# EAGLE design Adafruit tftcaptouchshield v2.3 (EAGLE 6.4)
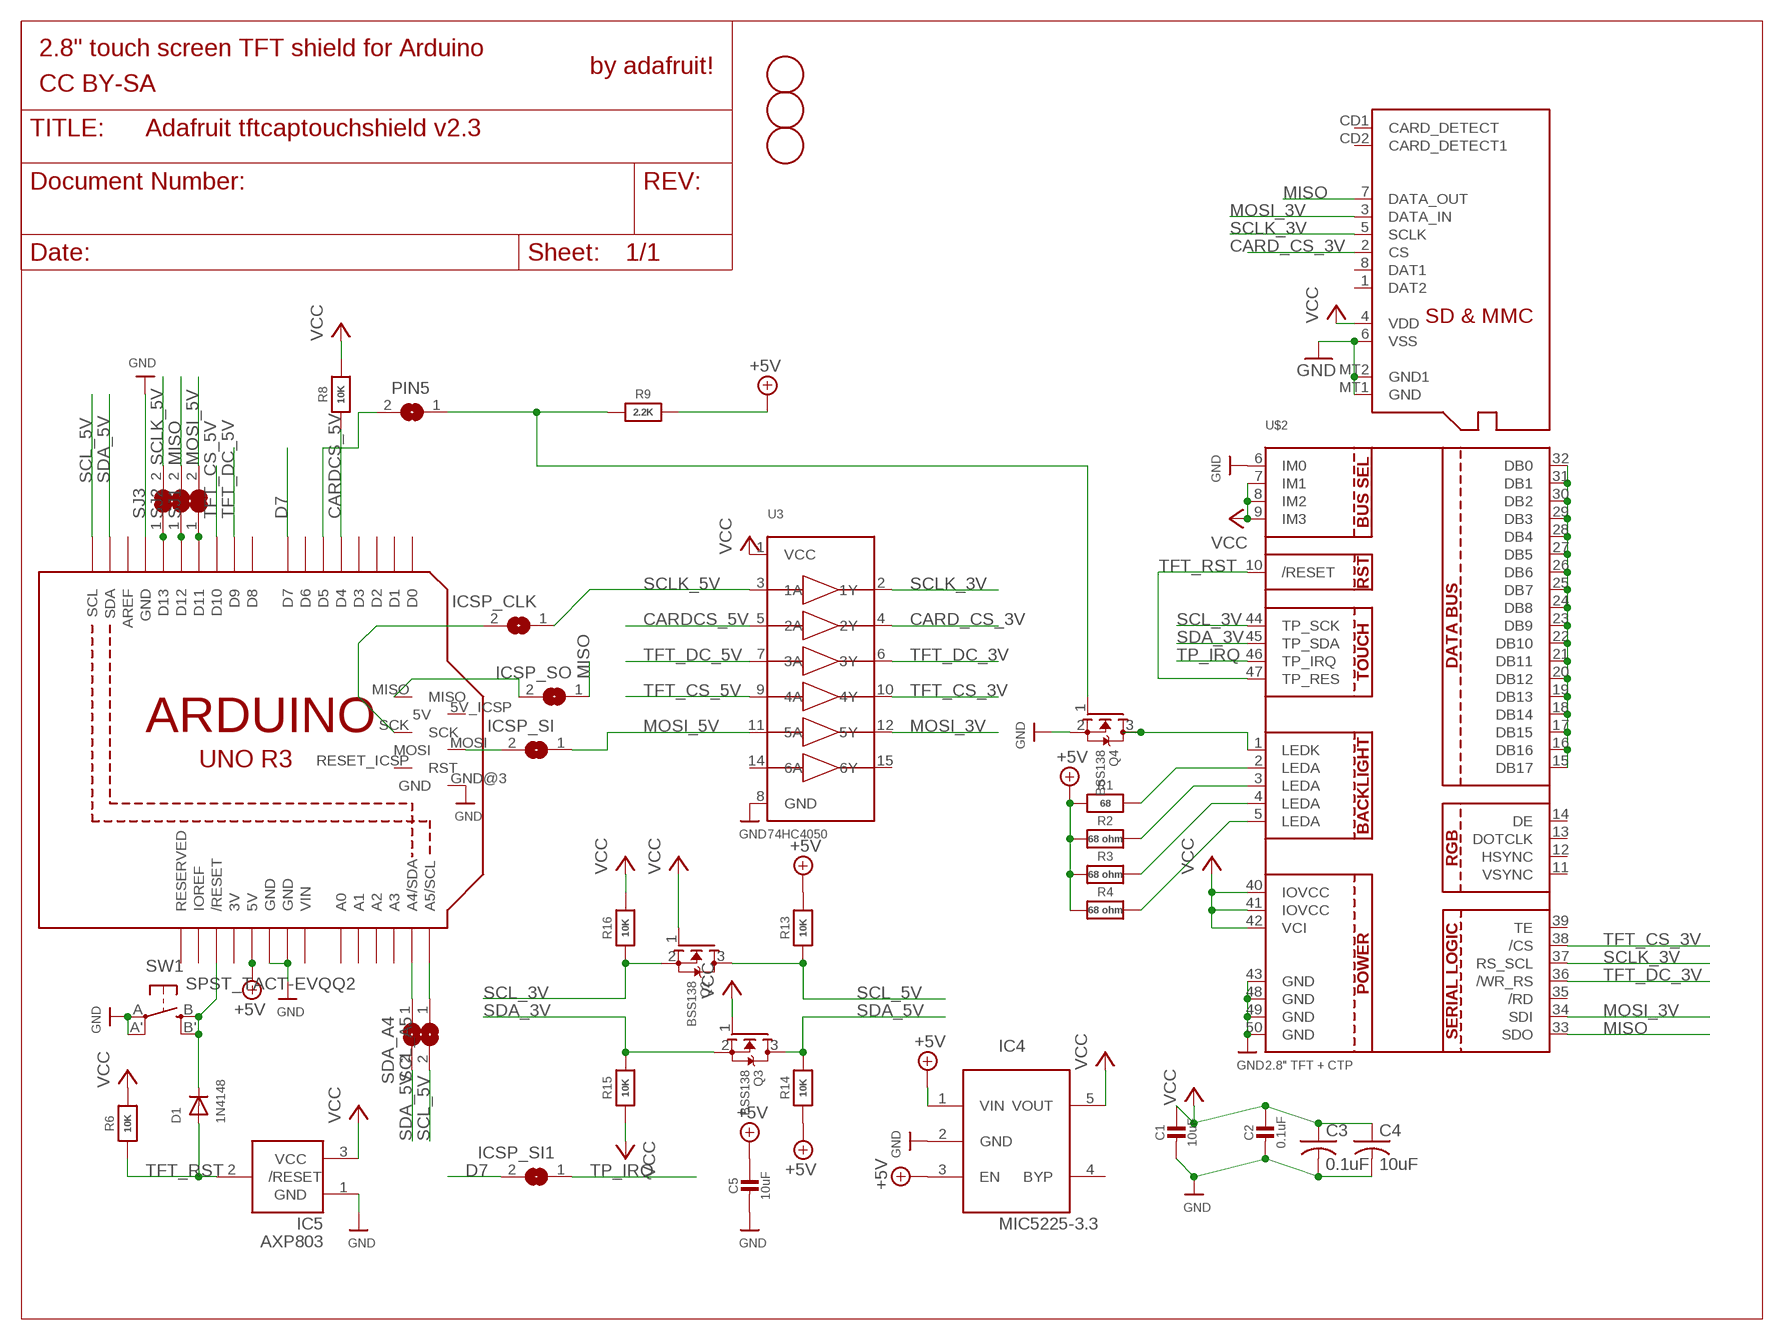
[diagram p0: schematic, sheet 1]

## Parts
C1  10uF  CAP_CERAMIC0805-NOOUTLINE  [0805-NO]
C2  0.1uF  CAP_CERAMIC0805-NOOUTLINE  [0805-NO]
C3  0.1uF  C-USC0805K  [C0805K]
C4  10uF  C-USC0805K  [C0805K]
C5  10uF  CAP_CERAMIC0805-NOOUTLINE  [0805-NO]
D1  1N4148  DIODESOD-323F  [SOD-323F]
IC4  MIC5225-3.3  LP298XS  [SOT23-5L]
IC5  AXP803  AXP083-SAG  [SOT23]
ICSP_CLK  SOLDERJUMPERREFLOW_NOPASTE  [SOLDERJUMPER_REFLOW_NOPASTE]
ICSP_SI  SOLDERJUMPERREFLOW_NOPASTE  [SOLDERJUMPER_REFLOW_NOPASTE]
ICSP_SI1  SOLDERJUMPERREFLOW_NOPASTE  [SOLDERJUMPER_REFLOW_NOPASTE]
ICSP_SO  SOLDERJUMPERREFLOW_NOPASTE  [SOLDERJUMPER_REFLOW_NOPASTE]
PIN5  SOLDERJUMPERREFLOW_NOPASTE  [SOLDERJUMPER_REFLOW_NOPASTE]
Q2  BSS138  MOSFET-NWIDE  [SOT23-WIDE]
Q3  BSS138  MOSFET-NWIDE  [SOT23-WIDE]
Q4  BSS138  MOSFET-NWIDE  [SOT23-WIDE]
R1  68  RESISTOR0805_NOOUTLINE  [0805-NO]
R2  68 ohm  RESISTOR0805_NOOUTLINE  [0805-NO]
R3  68 ohm  RESISTOR0805_NOOUTLINE  [0805-NO]
R4  68 ohm  RESISTOR0805_NOOUTLINE  [0805-NO]
R6  10K  RESISTOR0805_NOOUTLINE  [0805-NO]
R8  10K  RESISTOR0805_NOOUTLINE  [0805-NO]
R9  2.2K  RESISTOR0805_NOOUTLINE  [0805-NO]
R13  10K  RESISTOR0805_NOOUTLINE  [0805-NO]
R14  10K  RESISTOR0805_NOOUTLINE  [0805-NO]
R15  10K  RESISTOR0805_NOOUTLINE  [0805-NO]
R16  10K  RESISTOR0805_NOOUTLINE  [0805-NO]
SCL_A5  SOLDERJUMPERREFLOW_NOPASTE  [SOLDERJUMPER_REFLOW_NOPASTE]
SDA_A4  SOLDERJUMPERREFLOW_NOPASTE  [SOLDERJUMPER_REFLOW_NOPASTE]
SJ1  SOLDERJUMPER_CLOSED  [SOLDERJUMPER_CLOSEDWIRE]
SJ2  SOLDERJUMPER_CLOSED  [SOLDERJUMPER_CLOSEDWIRE]
SJ3  SOLDERJUMPER_CLOSED  [SOLDERJUMPER_CLOSEDWIRE]
SW1  SPST_TACT-EVQQ2  [EVQ-Q2]
U3  74HC4050  74HC4050D  [SOIC16]
U$2  2.8" TFT + CTP  DISP_LCD_CTP28_SAMPLE  [TFT_2.83IN_240X320_50PIN]
U$3  MICROSD  [MICROSD]
U$10  FIDUCIAL  [FIDUCIAL_1MM]
U$11  FIDUCIAL  [FIDUCIAL_1MM]
U$17  ARDUINO_R3_ICSPSMT  [ARDUINOR3_ICSP_SMT]
U$19  FIDUCIAL  [FIDUCIAL_1MM]

## Nets
+5V: C5.1 IC4.1(VIN) IC4.3(EN) R1.1 R2.1 R3.1 R4.1 R9.2 R13.2 R14.1 U$17.5V
CARD_CS_3V: U3.4(2Y) U$3.2(CS)
CARDCS_5V: R8.1 U3.5(2A) U$17.D4
D7: ICSP_SI1.2 U$17.D7
GND: C1.2 C2.2 C3.2 C4.2 C5.2 IC4.2(GND) IC5.1(GND) Q4.2(S) SW1.A'(P1) SW1.A(P) U3.8(GND) U$2.6(IM0) U$2.43(GND) U$2.48(GND) U$2.49(GND) U$2.50(GND) U$3.6(VSS) U$3.MT1(GND) U$3.MT2(GND1) U$17.GND U$17.GND@1(GND) U$17.GND@2(GND) U$17.GND@3(GND)
MISO: ICSP_SO.1 SJ2.2 U$2.33(SDO) U$3.7(DATA_OUT)
MOSI_3V: U3.12(5Y) U$2.34(SDI) U$3.3(DATA_IN)
MOSI_5V: ICSP_SI.1 SJ1.2 U3.11(5A)
N$1: Q4.3(D) U$2.1(LEDK)
N$2: R1.2 U$2.2(LEDA)
N$3: R2.2 U$2.3(LEDA)
N$4: R3.2 U$2.4(LEDA)
N$5: PIN5.1 Q4.1(G) R9.1
N$6: ICSP_SI.2 U$17.MOSI
N$7: PIN5.2 U$17.D5
N$8: D1.C SW1.B'(S1) SW1.B(S) U$17.RESET(/RESET)
N$9: U$2.15(DB17) U$2.16(DB16) U$2.17(DB15) U$2.18(DB14) U$2.19(DB13) U$2.20(DB12) U$2.21(DB11) U$2.22(DB10) U$2.23(DB9) U$2.24(DB8) U$2.25(DB7) U$2.26(DB6) U$2.27(DB5) U$2.28(DB4) U$2.29(DB3) U$2.30(DB2) U$2.31(DB1) U$2.32(DB0)
N$10: R4.2 U$2.5(LEDA)
N$11: ICSP_SO.2 U$17.MISO
N$12: ICSP_CLK.2 U$17.SCK
N$13: SJ3.1 U$17.D13
N$14: SJ2.1 U$17.D12
N$15: SJ1.1 U$17.D11
N$17: SDA_A4.1 U$17.A4(A4/SDA)
N$18: SCL_A5.1 U$17.A5(A5/SCL)
SCL_3V: Q2.2(S) R16.1 U$2.44(TP_SCK)
SCL_5V: Q2.3(D) R13.1 SCL_A5.2 U$17.SCL
SCLK_3V: U3.2(1Y) U$2.37(RS_SCL) U$3.5(SCLK)
SCLK_5V: ICSP_CLK.1 SJ3.2 U3.3(1A)
SDA_3V: Q3.2(S) R15.2 U$2.45(TP_SDA)
SDA_5V: Q3.3(D) R14.2 SDA_A4.2 U$17.SDA
TFT_CS_3V: U3.10(4Y) U$2.38(/CS)
TFT_CS_5V: U3.9(4A) U$17.D10
TFT_DC_3V: U3.6(3Y) U$2.36(/WR_RS)
TFT_DC_5V: U3.7(3A) U$17.D9
TFT_RST: D1.A IC5.2(/RESET) R6.1 U$2.10(/RESET) U$2.47(TP_RES)
TP_IRQ: ICSP_SI1.1 U$2.46(TP_IRQ)
VCC: C1.1 C2.1 C3.1 C4.1 IC4.5(VOUT) IC5.3(VCC) Q2.1(G) Q3.1(G) R6.2 R8.2 R15.1 R16.2 U3.1(VCC) U$2.7(IM1) U$2.8(IM2) U$2.9(IM3) U$2.40(IOVCC) U$2.41(IOVCC) U$2.42(VCI) U$3.4(VDD)
Unconnected: IC4.4(BYP) U3.14(6A) U3.15(6Y) U$2.11(VSYNC) U$2.12(HSYNC) U$2.13(DOTCLK) U$2.14(DE) U$2.35(/RD) U$2.39(TE) U$3.1(DAT2) U$3.8(DAT1) U$3.CD1(CARD_DETECT) U$3.CD2(CARD_DETECT1) U$17.5V_ICSP(5V) U$17.A0 U$17.A1 U$17.A2 U$17.A3 U$17.AREF U$17.D0 U$17.D1 U$17.D2 U$17.D3 U$17.D6 U$17.D8 U$17.IOREF U$17.RESERVED U$17.RESET_ICSP(RST)

## Notes on the sheet
- 2.8" touch screen TFT shield for Arduino
- by adafruit!
- CC BY-SA

## Power pins joined to a net without a drawn wire
3V: U$17.3V
VIN: U$17.VIN

## Library data of the parts
C1 C2 C5 = microbuilder:CAP_CERAMIC: Ceramic Capacitors For new designs, use the packages preceded by an '_' character since they are more reliable: The following footprints should be used on most boards: _0402 - Standard footprint for regular board layouts _0603 - Standard footprint for regular board layouts _0805 - Standard footprint for regular board layouts _1206 - Standard footprint for regular board layouts For extremely tight-pitch boards where space is at a premium, the following 'micro-pitch' footprints can be used (smaller pads, no silkscreen outline, etc.): _0402MP - Micro-pitch footprint for very dense/compact boards _0603MP - Micro-pitch footprint for very dense/compact boards _0805MP - Micro-pitch footprint for very dense/compact boards _1206MP - Micro-pitch footprint for very dense/compact boards
C3 C4 = adafruit:C-US: CAPACITOR, American symbol
D1 = adafruit:DIODE: Diode SMADIODE - SMA Surface Mount Package 20V 1A Schottky Diode Digikey: 641-1014-6-ND DO-1N4148 - Through Hole Small Current Diode SOD-123 20V 1 A (.5mV Vf) Schottky Diode - Digikey: MBRX120TPMSCT-ND SOD-323 10V 570mA (.38mV Vf, 3ns) Schottky Diode - Digikey: ZLLS410CT-ND SOD-523 30V 30mA Schottky Diode (RB751S-40TE61) - Digikey: RB751S-40TE61CT-ND SOT23-R/W - SOT23 Package (R = Solder Paste/Reflow Ovens, W = Hand-Soldering) BAT54Film 40V 300mA - Digikey: 497-7162-1-ND
IC4 = adafruit:LP298X
IC5 = adafruit:AXP083
ICSP_CLK ICSP_SI ICSP_SI1 ICSP_SO PIN5 SCL_A5 SDA_A4 = microbuilder:SOLDERJUMPER: SMD Solder JUMPER Solder the two pads together to create a connection, or remove the solder to break it. REFLOW - Use this footprint for solder paste and reflow ovens. WAVE - Use this footprint for hand-soldering (larger pads). CLOSED - Has a trace between the two pads to ensure it is closed by default. The trace needs to be cut to disable the jumper, and can be closed again by creating a solder bridge between the two pads.
Q2-Q4 = microbuilder:MOSFET-N: N-Channel Mosfet LEGEND VDS: Voltage Drain-Source ID: Drain Current RDS(ON): Drain-Source On-State Resistance VGS(TH): Gate-Source Threshold Voltage CISS: Drain-Source Input Capacitance SOT-23 Name VDS ID RDS(ON) VGS(TH) CISS Order Number 2N7002E 60V 260mA 2.5 Ohm 2.5V @ 250uA 26.7pF @ 25V 2N7002ET1GOSTR-ND BSH103 30V 850mA 400 mOhm 400mV @ 1mA 83pF @ 24V BSH103,235-ND BSS138 60V 320mA 1.6 Ohm 1.5V @ 250uA 50pF @ 10V Mouser: 771-BSS138PW115 DMN2075U-7 20V 4.2A 38 mOhm 1V @ 250 uA 594.3pF @ 10V DMN2075U-7DICT-ND * BSS138 good choice for I2C level-shifting POWERPAK 1212-8 Name VDS ID RDS(ON) VGS(TH) CISS Order Number Si7308DN 60V 6A 58 mOhm 3V @ 250uA 665pF @ 15V SI7308DN-T1-E3CT-ND
R1-R4 R6 R8 R9 R13-R16 = microbuilder:RESISTOR: Resistors For new designs, use the packages preceded by an '_' character since they are more reliable: The following footprints should be used on most boards: _0402 - Standard footprint for regular board layouts _0603 - Standard footprint for regular board layouts _0805 - Standard footprint for regular board layouts _1206 - Standard footprint for regular board layouts For extremely tight-pitch boards where space is at a premium, the following 'micro-pitch' footprints can be used (smaller pads, no silkscreen outline, etc.): _0402MP - Micro-pitch footprint for very dense/compact boards _0603MP - Micro-pitch footprint for very dense/compact boards _0805MP - Micro-pitch footprint for very dense/compact boards _1206MP - Micro-pitch footprint for very dense/compact boards
SJ1-SJ3 = microbuilder:SOLDERJUMPER_CLOSED: Solder Jumper - Closed These solder jumpers are closed by default CLOSEDWIRE - 10 mil trace between pads that can be cut and resoldered later CLOSEDPERM - 63 mil trace between pads for a permanent connection (used to 'bridge' two signals, a shameless hack for Eagle). Can double as a test point as well (no cream layer)
SW1 = adafruit:SPST_TACT: SMT 6mm switch, EVQQ2 series http://www.ladyada.net/library/eagle
U3 = microbuilder:74HC4050D: 6-channel level shifter 74HC4050D - 2V-6V Supply SOIC16 Digikey: 74HC4050D,653-ND Mouser: 771-74HC4050D-T TSSOP16 Digikey: 296-9215-1-ND Mouser:
U$2 = microbuilder:DISP_LCD_CTP28: 2.83" 240x320 Pixel Capacitive Touch Display
U$3 = adafruit:MICROSD: Micro-SD / Transflash card holder with SPI pinout For the 3M # 2908-05WB-MG and/or 4UCON #19656 push-push type
U$10 U$11 U$19 = adafruit:FIDUCIAL: For use by pick and place machines to calibrate the vision/machine, 1mm By microbuilder.eu
U$17 = adafruit:ARDUINO_R3_ICSP

## Board
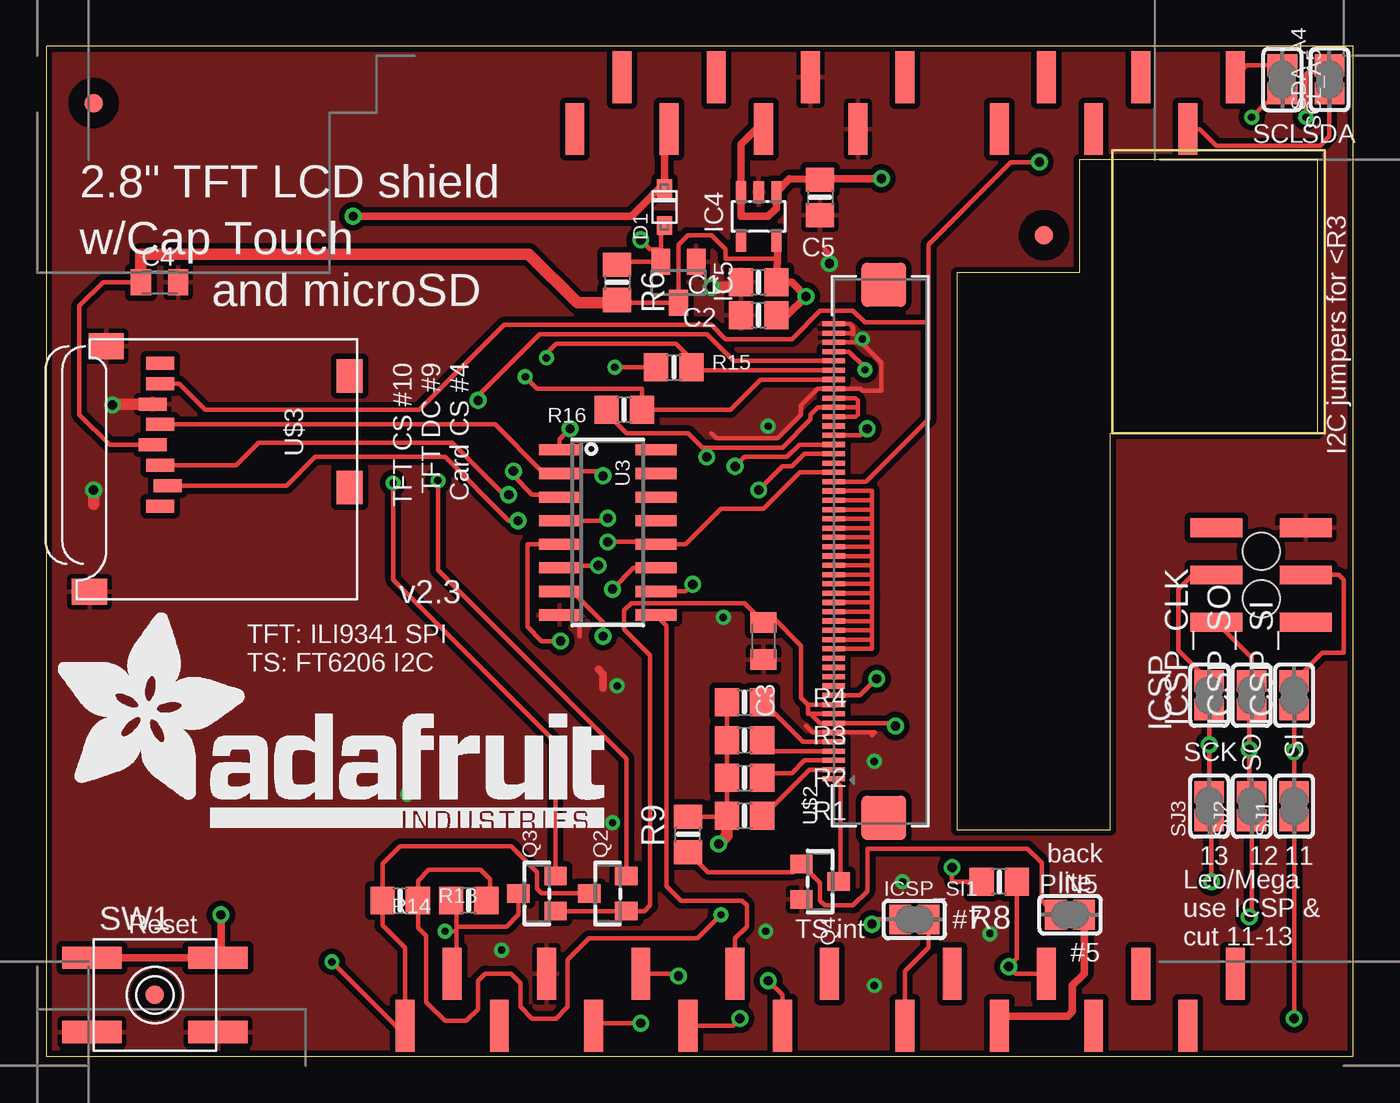
[diagram p1: board, top side]
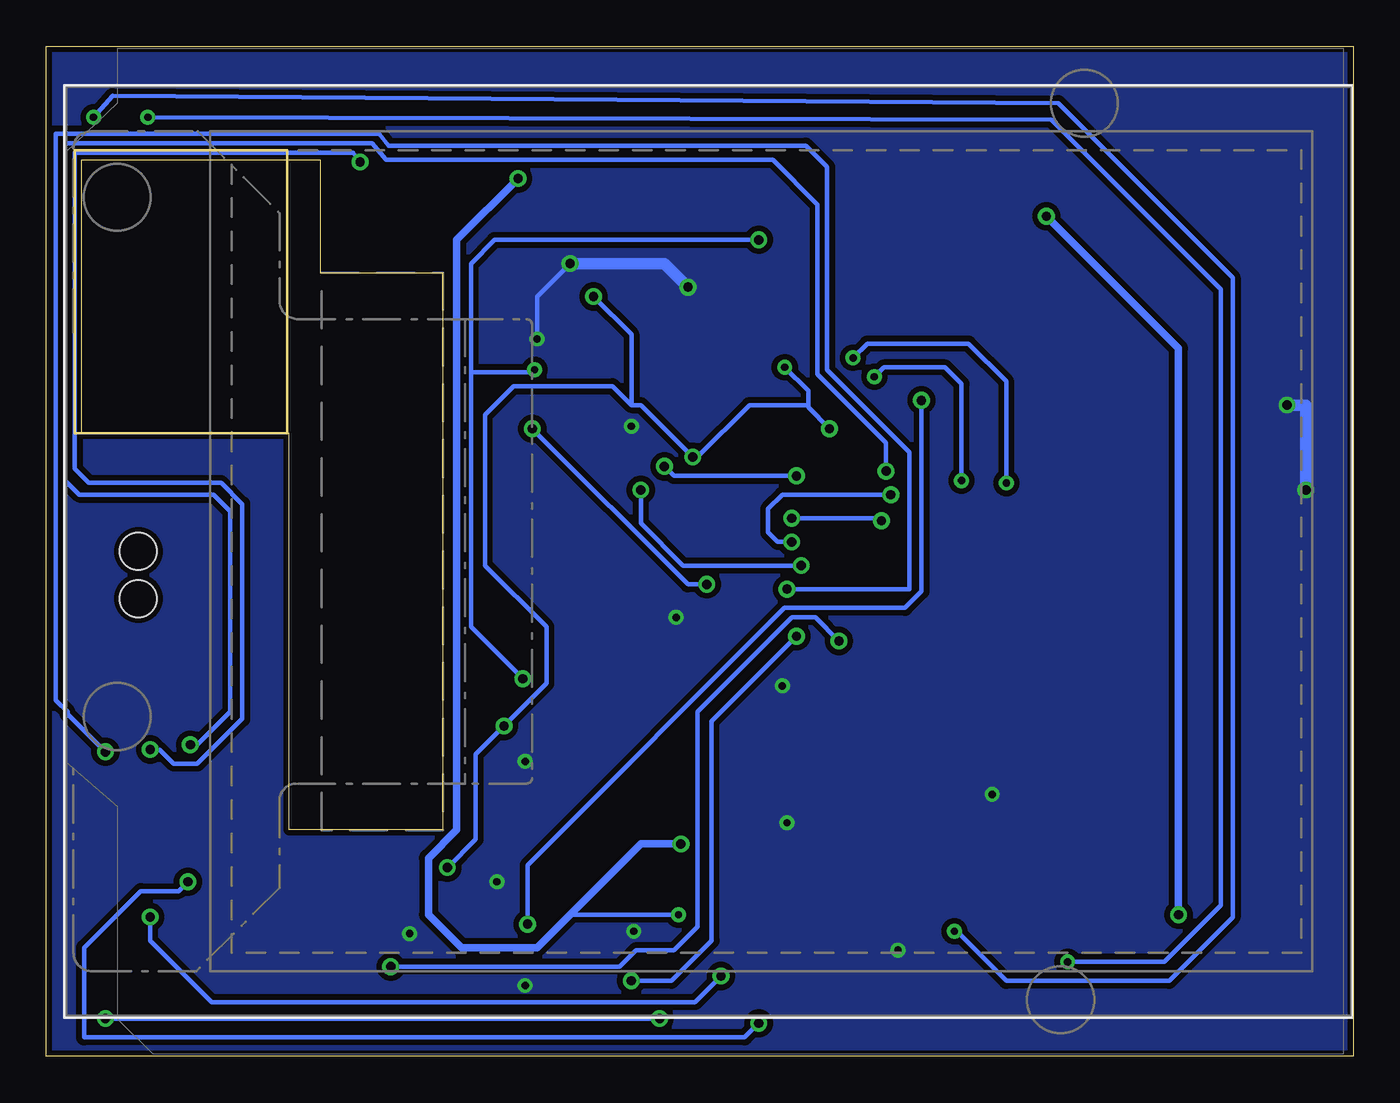
[diagram p2: board, bottom side, seen from below]

Size 70.36 x 54.36 mm. Coordinates in mm from the lower left corner, seen from the top.
Outline: 0,54.36 0,0 70.36,0 70.36,54.36 0,54.36
Outline: 49.02,42.16 49.02,12.19 57.28,12.19 57.28,33.53 68.45,33.53 68.45,48.26 55.63,48.26 55.63,42.16 49.02,42.16
Copper layers (1*16): Top 0.035mm / dielectric 1.5mm / Bottom 0.035mm
Design rules "adafruit *": minimum track width 8mil, minimum drill 15.5mil, track to track 8mil, track to pad 8mil, pad to pad 8mil, via to via 8mil, smd to smd 8mil, copper to edge 10mil, drill to drill 8mil, minimum pad ring 10mil, minimum via ring 8mil, stop-mask expansion 2mil, vias tented up to drill 20mil, thermal gap 10mil
tRestrict: area 42.2,38.6 to 42.7,38.7; area 42.3,39.1 to 42.5,39.2

### Footprints (pad centres in the part's own frame; a part is rotated, then mirrored left to right if it is on the bottom)
0805-NO = smd 1.3 x 1.5: 1 -0.95,0; 2 0.95,0
C0805K = smd 1.1 x 1.4: 1 -1,0; 2 1,0
SOD-323F = smd 1 x 0.8: A -1,0; C 1,0
SOT23-5L = smd 0.55 x 1.2: 1 -0.95,-1.3; 2 0,-1.3; 3 0.95,-1.3; 4 0.95,1.3; 5 -0.95,1.3
SOT23 = smd 1 x 1.4: 1 -0.95,-1.1; 2 0.95,-1.1; 3 0,1.1
SOLDERJUMPER_REFLOW_NOPASTE = smd 1.168 x 1.6: 1 -0.762,0; 2 0.762,0
SOT23-WIDE = smd 1 x 1.2: 1 -0.95,-1; 2 0.95,-1; 3 0,1
SOLDERJUMPER_CLOSEDWIRE = smd 1.168 x 1.6: 1 -0.762,0; 2 0.762,0 | smd 0.635 x 0.203: WIRE 0,0
EVQ-Q2 = smd 3.2 x 1.2: A -3.4,-2; A' 3.4,-2; B -3.4,2; B' 3.4,2
SOIC16 = smd 0.6 x 2.2: 1 -4.445,-2.6; 2 -3.175,-2.6; 3 -1.905,-2.6; 4 -0.635,-2.6; 5 0.635,-2.6; 6 1.905,-2.6; 7 3.175,-2.6; 8 4.445,-2.6; 9 4.445,2.6; 10 3.175,2.6; 11 1.905,2.6; 12 0.635,2.6; 13 -0.635,2.6; 14 -1.905,2.6; 15 -3.175,2.6; 16 -4.445,2.6
TFT_2.83IN_240X320_50PIN = smd 0.275 x 1.2 bottom: 1 12.25,-10.39; 2 11.75,-10.39; 3 11.25,-10.39; 4 10.75,-10.39; 5 10.25,-10.39; 6 9.75,-10.39; 7 9.25,-10.39; 8 8.75,-10.39; 9 8.25,-10.39; 10 7.75,-10.39; 11 7.25,-10.39; 12 6.75,-10.39; 13 6.25,-10.39; 14 5.75,-10.39; 15 5.25,-10.39; 16 4.75,-10.39; 17 4.25,-10.39; 18 3.75,-10.39; 19 3.25,-10.39; 20 2.75,-10.39; 21 2.25,-10.39; 22 1.75,-10.39; 23 1.25,-10.39; 24 0.75,-10.39; 25 0.25,-10.39; 26 -0.25,-10.39; 27 -0.75,-10.39; 28 -1.25,-10.39; 29 -1.75,-10.39; 30 -2.25,-10.39; 31 -2.75,-10.39; 32 -3.25,-10.39; 33 -3.75,-10.39; 34 -4.25,-10.39; 35 -4.75,-10.39; 36 -5.25,-10.39; 37 -5.75,-10.39; 38 -6.25,-10.39; 39 -6.75,-10.39; 40 -7.25,-10.39; 41 -7.75,-10.39; 42 -8.25,-10.39; 43 -8.75,-10.39; 44 -9.25,-10.39; 45 -9.75,-10.39; 46 -10.25,-10.39; 47 -10.75,-10.39; 48 -11.25,-10.39; 49 -11.75,-10.39; 50 -12.25,-10.39 | smd 2.4 x 2.4 bottom: PAD1 14.35,-13.09; PAD2 -14.35,-13.09
MICROSD = smd 0.7 x 1.5: 1 9,-10.64; 2 7.9,-10.24; 3 6.8,-10.64; 4 5.7,-11.04; 5 4.6,-10.64; 6 3.5,-11.04; 7 2.4,-10.64; 8 1.3,-10.64 | smd 1.8 x 1.4: CD1 2,-0.44; CD2 8,-0.44 | smd 1.4 x 1.9: MT1 0.4,-13.54; MT2 13.6,-14.44
FIDUCIAL_1MM = smd 1 x 1: 1 0,0
ARDUINOR3_ICSP_SMT = smd 1.016 x 2.794 bottom: 3V 35.56,1.143; 5V 38.1,3.937; A0 50.8,3.937; A1 53.34,1.143; A2 55.88,3.937; A3 58.42,1.143; A4 60.96,3.937; A5 63.5,1.143; AREF 23.876,52.197; D0 63.5,49.403; D1 60.96,52.197; D2 58.42,49.403; D3 55.88,52.197; D4 53.34,49.403; D5 50.8,52.197; D6 48.26,49.403; D7 45.72,52.197; D8 41.656,49.403; D9 39.116,52.197; D10 36.576,49.403; D11 34.036,52.197; D12 31.496,49.403; D13 28.956,52.197; GND 26.416,49.403; GND@1 43.18,3.937; GND@2 40.64,1.143; IOREF 30.48,1.143; RESERVED 27.94,3.937; RESET 33.02,3.937; SCL 18.796,52.197; SDA 21.336,49.403; VIN 45.72,1.143 | smd 2.794 x 1.016 bottom: 5V_ICSP 67.31,30.48; GND@3 67.31,25.4; MISO 62.484,30.48; MOSI 67.31,27.94; RESET_ICSP 62.484,25.4; SCK 62.484,27.94 | hole 2: 64.897,29.21; 64.897,26.67

### Placement (x,y rotation side)
C1  38.35,41.66 180 top
C2  38.35,39.88 180 top
C3  38.61,22.35 270 top
C4  6.1,41.66 0 top
C5  41.66,46.23 270 top
D1  33.27,45.72 90 top
IC4  38.35,45.21 180 top
IC5  34.04,41.66 180 top
ICSP_CLK  62.61,19.43 90 top
ICSP_SI  67.18,19.43 90 top
ICSP_SI1  46.74,7.37 0 top
ICSP_SO  64.9,19.43 90 top
PIN5  55.12,7.62 0 top
Q2  30.23,8.76 90 top
Q3  26.42,8.76 90 top
Q4  41.66,9.4 270 top
R1  37.59,12.95 0 top
R2  37.59,14.99 0 top
R3  37.59,17.02 0 top
R4  37.59,19.05 0 top
R6  30.73,41.66 270 top
R8  51.31,9.4 180 top
R9  34.54,11.94 90 top
R13  19.05,8.38 0 top
R14  22.73,8.38 180 top
R15  33.78,37.08 0 top
R16  31.11,34.8 180 top
SCL_A5  66.55,52.58 270 top
SDA_A4  69.09,52.58 90 top
SJ1  67.18,13.46 90 top
SJ2  64.9,13.46 90 top
SJ3  62.61,13.46 90 top
SW1  5.84,3.3 0 top
U3  30.23,28.19 270 top
U$2  32,27.18 270 bottom
U$3  16.76,38.61 270 top
U$10  53.72,44.2 180 top
U$11  5.84,3.3 180 top
U$17  0.51,53.85 180 bottom
U$19  2.54,51.31 0 top
U$20  [ADAFRUIT_TEXT_30MM]  0.38,12.32 0 top

### Tracks (layer width: path | path; a pad name or v marks a point on that pad's centre or on a via)
+5V  (via drill 0.39, 0.5)
  Top 0.254: R9.2 36.58,12.89 R1.1 R2.1 R3.1 R4.1 | v36.32,7.62 35.05,6.35 29.21,6.35 28.07,5.21 28.07,2.67 27.43,2.03 26.16,2.03 25.53,2.67 25.53,3.94 25.02,4.45 23.62,4.45 23.24,4.06 23.24,2.54 22.61,1.91 21.46,1.91 20.45,2.92 20.45,6.48 20,6.92 R13.2 20,9.46 20.57,10.03 23.37,10.03 23.88,9.53 23.88,8.45 23.75,8.45 R14.1
  Top 0.406: v44.96,47.24 41.67,47.24 C5.1 40.02,47.23 IC4.1 39.3,45.65 38.86,45.21 37.4,45.21 IC4.3 37.4,49.09 38.61,50.29 U$17.5V
  Top 0.61: v36.2,11.43 36.64,11.88 R1.1
  Bottom 0.254: v36.32,7.62 42.16,7.62
  Bottom 0.406: v36.2,11.43 38.35,11.43 42.16,7.62 43.94,5.84 48.01,5.84 49.78,7.62 49.78,10.67 48.26,12.19 48.26,43.94 v44.96,47.24
CARD_CS_3V  (via drill 0.5)
  Top 0.254: U$3.2 12.93,30.71 14.48,32.26 21.46,32.26 24.89,28.83 v25.4,28.83 | v30.23,28.96 30.1,28.83 U3.4
  Bottom 0.254: v25.4,28.83 25.53,28.96 v30.23,28.96
CARDCS_5V  (via drill 0.5)
  Top 0.254: U3.5 25.91,27.56 25.91,23.11 26.67,22.35 v27.69,22.35 | U$17.D4 52.2,4.45 v51.82,4.83 52.26,5.27 R8.1
  Bottom 0.254: v27.69,22.35 28.96,23.62 30.23,23.62 35.31,18.54 35.31,6.99 36.58,5.71 38.61,5.71 39.5,4.83 v51.82,4.83
D7
  Top 0.254: U$17.D7 46.23,4.57 47.5,5.84 ICSP_SI1.2
GND  (via drill 0.39, 0.5)
  Top 0.254: 44.45,17.27 44.61,17.43 U$2.6 41.25,17.43 40.89,17.78 | U$2.48 43.87,38.43 44.96,37.34 44.96,35.81 43.94,35.81 43.83,35.93 U$2.43 41.52,35.93 40.64,35.05 40.64,34.54 39.37,33.27 36.07,33.27 35.82,33.52 | v42.16,42.67 42.16,43.18 41.91,43.43 | U3.8 28.07,23.75 28.7,23.11 28.7,22.61 | U$2.50 43.25,39.43 43.43,39.24 43.43,38.86 | U$2.49 43.37,38.93
  Top 0.406: 29.97,19.81 29.97,20.57 29.72,20.83
  Top 0.61: C1.2 37.1,41.4 v35.81,41.4 | U$3.6 3.56,35.11 v3.56,35.05 | v2.54,30.48 2.54,29.72
  Bottom 0.254: v43.94,38.61 43.94,40.89 v42.16,42.67
  Bottom 0.61: v35.81,41.4 37.08,42.67 v42.16,42.67 | v3.56,35.05 2.54,35.05 v2.54,30.48
  other vias: 24.51,5.71 44.58,15.88 44.58,3.81 19.43,14.1 30.48,12.57 36.45,23.62 30.73,19.94 38.86,33.91 46.1,9.4 50.8,6.6 38.73,6.73
  pour Bottom (isolate 0.305): -0.25,-0.13 -0.25,54.61 70.36,54.61 70.36,-0.13
  pour Top (isolate 0.305): 0,-0.13 0,54.74 70.61,54.74 70.61,-0.13
MISO  (via drill 0.5)
  Top 0.254: 42.42,30.9 U$2.33 44.14,30.93 47.5,34.29 47.5,39.5 | U$3.7 7.14,36.21 8.55,34.8 20.07,34.8 24.64,39.37 35.81,39.37 36.58,38.61 40.13,38.61 41.66,40.13 43.43,40.13 44.07,39.5 47.5,39.5 | 47.5,39.5 47.5,43.69 51.94,48.13 v53.47,48.13 | ICSP_SO.1 64.77,18.54 v64.77,16.51 64.77,14.35 SJ2.2
  Bottom 0.254: v53.47,48.13 53.85,48.64 68.83,48.64 68.83,31.62 68.07,30.86 60.96,30.86 59.82,29.72 59.82,18.16 62.23,15.75 63.5,15.75 64.26,16.51 v64.77,16.51 64.64,16.64
MOSI_3V  (via drill 0.5)
  Top 0.254: U$2.34 40.57,31.43 38.61,29.46 36.32,29.46 34.42,27.56 U3.12 32.7,27.69 v30.23,27.69 | U$3.3 10.22,31.81 11.43,33.02 21.84,33.02 24.64,30.23 v24.89,30.23
  Bottom 0.254: v30.23,27.69 30.99,27.69 31.5,28.19 31.5,29.46 30.73,30.23 v24.89,30.23
MOSI_5V  (via drill 0.5)
  Top 0.254: v30.48,25.15 31.62,26.29 U3.11 | ICSP_SI.1 v67.18,16.38 67.18,16.26 SJ1.2
  Bottom 0.254: v30.48,25.15 23.88,25.15 23.88,32.51 28.32,36.96 28.32,47.88 29.46,49.02 51.94,49.02 52.45,49.66 69.85,49.66 69.85,19.18 69.22,18.54 69.22,18.41 v67.18,16.38
N$1
  Top 0.254: U$2.1 42.76,14.57 42.76,9.5 Q4.3
N$2
  Top 0.254: U$2.2 41.08,15.43 38.61,12.95 R1.2
N$3
  Top 0.254: U$2.3 40.82,15.93 40.13,15.24 38.8,15.24 R2.2
N$4
  Top 0.254: U$2.4 39.13,16.43 R3.2
N$5
  Top 0.254: PIN5.1 53.59,8.38 53.59,10.41 52.83,11.18 44.2,11.18 44.2,8.89 43.43,8.13 41.91,8.13 41.66,8.38 41.66,9.35 Q4.1 40.21,9.91 35.63,9.91 R9.1
N$6
  Top 0.254: ICSP_SI.2 68.71,21.72 69.85,21.72 69.85,25.65 69.6,25.91 U$17.MOSI
N$7
  Top 0.406: U$17.D5 51.31,2.16 54.99,2.16 55.24,2.41 55.24,3.81 55.88,4.45 PIN5.2
N$8  (via drill 0.5)
  Top 0.406: SW1.B SW1.B' 9.4,5.3 v9.4,7.62 | v16.51,45.21 31.51,45.21 33.02,46.72 D1.C 33.27,49.66 U$17.RESET
  Bottom 0.406: v9.4,7.62 9.4,38.1 v16.51,45.21
N$9
  Top 0.254: U$2.15 44.45,21.93 44.45,22.43 | 44.45,22.43 44.45,22.93 | 44.45,22.93 44.45,23.43 | 44.45,23.43 44.45,23.93 | 44.45,23.93 44.45,24.43 | 44.45,24.93 44.45,25.43 | 44.45,25.43 44.45,25.93 | 44.45,25.93 44.45,26.43 | 44.45,26.43 44.45,26.93 | 44.45,26.93 44.45,27.43 | 44.45,27.43 44.45,27.93 | 44.45,27.93 44.45,28.43 | 44.45,28.43 44.45,28.93 | 44.45,28.93 44.45,29.43 | 44.45,29.43 44.45,29.93 | 44.45,29.93 44.45,30.43 U$2.32 | U$2.31 44.45,29.93 | U$2.30 44.45,29.43 | U$2.29 44.45,28.93 | U$2.28 44.45,28.43 | U$2.27 44.45,27.93 | U$2.26 44.45,27.43 | U$2.25 44.45,26.93 | U$2.24 44.45,26.43 | U$2.23 44.45,25.93 | U$2.22 44.45,25.43 | U$2.21 44.45,24.93 | 44.45,24.93 44.45,24.43 | U$2.20 44.45,24.43 | U$2.19 44.45,23.93 | U$2.18 44.45,23.43 | U$2.17 44.45,22.93 | U$2.16 44.45,22.43
N$10
  Top 0.254: U$2.5 40.73,16.93 38.61,19.05 R4.2
N$11
  Top 0.254: U$17.MISO 64.9,21.46 ICSP_SO.2
N$12
  Top 0.254: ICSP_CLK.2 60.96,21.84 60.96,25.15 61.72,25.91 U$17.SCK
N$13  (via drill 0.5)
  Top 0.254: U$17.D13 29.59,1.78 v32,1.78 | v62.74,9.4 62.74,12.57 SJ3.1
  Bottom 0.254: v32,1.78 32.77,1.02 68.33,1.02 68.33,5.84 65.28,8.89 63.25,8.89 v62.74,9.4
N$14  (via drill 0.5)
  Top 0.254: v34.04,4.32 33.91,4.45 U$17.D12 | v64.77,7.49 64.9,7.62 SJ2.1
  Bottom 0.254: v34.04,4.32 35.43,2.92 61.47,2.92 64.77,6.22 v64.77,7.49
N$15  (via drill 0.5)
  Top 0.254: v37.34,2.03 36.96,1.65 U$17.D11 | SJ1.1 v67.18,2.03
  Bottom 0.254: v67.18,2.03 v37.34,2.03
N$17
  Top 0.254: U$17.A4 62.1,49.91 62.99,49.02 68.58,49.02 69.09,49.53 SDA_A4.1
N$18
  Top 0.254: U$17.A5 64.64,53.34 SCL_A5.1
SCL_3V  (via drill 0.39)
  Top 0.254: Q2.2 31.23,16.02 21.08,26.16 v21.08,30.99 | v25.78,36.58 26.42,35.94 32.06,35.94 R16.1 36.83,34.8 38.46,36.43 U$2.44
  Bottom 0.254: v21.08,30.99 21.08,36.2 21.97,37.08 25.27,37.08 v25.78,36.58
SCL_5V  (via drill 0.39)
  Top 0.254: U$17.SCL 19.24,1.71 | Q2.3 26.67,8.76 26.42,9.02 26.42,9.91 25.02,11.3 19.05,11.3 18.1,10.35 R13.1 18.1,7.05 19.3,5.84 U$17.SCL | v15.37,5.08 19.3,1.14 19.56,1.14 19.3,1.4 U$17.SCL | SCL_A5.2 65.66,51.31 v64.9,50.55
  Bottom 0.254: v64.9,50.55 16.26,50.42 7.11,41.27 7.11,8.13 10.16,5.08 v15.37,5.08
SCLK_3V  (via drill 0.5)
  Top 0.254: v29.97,31.24 29.72,31.5 27.75,31.5 U3.2 27.5,31.5 26.67,31.5 24.16,34.01 U$3.5 | U$2.37 40.55,32.93 39.88,32.26 37.59,32.26 v37.08,31.75
  Bottom 0.254: v37.08,31.75 36.58,31.24 v29.97,31.24
SCLK_5V  (via drill 0.5)
  Top 0.254: v25.15,31.5 25.15,31.24 26.16,30.23 27.5,30.23 U3.3 | ICSP_CLK.1 v62.61,16.76 62.61,16.13 SJ3.2
  Bottom 0.254: v25.15,31.5 25.15,33.02 28.83,36.7 28.83,45.85 31.24,48.26 52.07,48.26 52.83,49.15 69.34,49.15 69.34,30.99 68.58,30.23 61.34,30.23 60.45,29.34 60.45,18.54 62.23,16.76 v62.61,16.76
SDA_3V  (via drill 0.39)
  Top 0.254: Q3.2 27.42,16.91 18.67,25.65 v18.67,30.86 | v26.92,37.59 26.92,37.85 27.43,38.35 33.91,38.35 34.73,37.53 R15.2 34.89,36.93 U$2.45
  Bottom 0.254: v18.67,30.86 18.67,36.32 20.7,38.35 26.16,38.35 v26.92,37.59
SDA_5V  (via drill 0.39)
  Top 0.254: U$17.SDA 22.1,4.7 22.1,6.73 | 22.1,6.73 22.1,6.99 | 22.1,6.99 22.1,8.19 21.97,8.19 R14.2 | Q3.3 25.42,7.64 24.77,6.99 22.1,6.99 | v21.46,6.73 22.1,6.73 | v67.82,50.55 67.82,52.83 67.94,52.96 68.96,52.96 SDA_A4.2
  Bottom 0.254: v21.46,6.73 21.46,6.86 18.67,4.06 9.91,4.06 6.48,7.49 6.48,41.91 15.88,51.31 66.8,51.69 v67.82,50.55
TFT_CS_3V  (via drill 0.5)
  Top 0.254: U3.10 34.42,25.02 v34.8,25.4 | v44.2,33.78 43.84,33.43 U$2.38
  Bottom 0.254: v34.8,25.4 35.81,25.4 v44.2,33.78
TFT_CS_5V
  Top 0.254: 37.08,4.32 U$17.D10 37.08,6.35 37.72,6.99 37.72,8.13 37.47,8.38 34.16,8.38 33.4,9.14 33.4,23.17 U3.9
TFT_DC_3V  (via drill 0.5)
  Top 0.254: v29.72,26.42 27.75,26.42 U3.6 | U$2.36 40.81,32.43 40.13,31.75 39.62,31.75 v38.35,30.48
  Bottom 0.254: v29.72,26.42 36.07,26.42 38.35,28.7 v38.35,30.48
TFT_DC_5V  (via drill 0.5)
  Top 0.254: v29.97,22.61 29.97,23.37 28.19,25.15 27.75,25.15 U3.7 | U$17.D9 39.62,3.3 v38.86,4.06
  Bottom 0.254: v29.97,22.61 34.54,18.03 34.54,6.22 36.7,4.06 v38.86,4.06
TFT_RST  (via drill 0.39, 0.5)
  Top 0.254: D1.A 33.09,44.53 33.09,43.43 | 33.09,43.43 IC5.2 30.88,42.76 R6.1 | U$2.10 43.81,19.43 v44.7,20.32 | v32,43.94 32.51,43.43 33.09,43.43 | U$2.47 43.23,37.93 44.07,37.08 v44.07,36.96
  Bottom 0.254: v44.7,20.32 47.5,23.11 47.5,36.83 | 47.5,36.83 47.5,42.67 46.23,43.94 v32,43.94 | v44.07,36.96 44.2,36.83 47.5,36.83
TP_IRQ  (via drill 0.5)
  Top 0.254: v44.45,7.11 44.7,7.37 ICSP_SI1.1 | U$2.46 36.99,37.43 35.56,38.86 26.54,38.86 23.24,35.56 v23.24,35.31
  Bottom 0.254: v23.24,35.31 23.24,25.02 24.13,24.13 30.61,24.13 44.45,10.29 v44.45,7.11
VCC  (via drill 0.39, 0.5)
  Top 0.254: U$2.9 41.02,18.93 | 41.02,18.93 40.64,19.3 40.64,22.1 39.12,23.62 38.88,23.62 C3.1 37.58,24.38 31.5,24.38 31.11,24 31.11,22.99 32.51,21.59 32.51,8.13 32.2,7.81 Q2.1 Q3.1 | R6.2 30.88,40.56 31.24,40.56 IC5.3 34.04,43.69 34.54,44.2 35.81,44.2 36.58,43.43 36.58,42.93 39.35,42.93 | 35.56,32.77 35.32,32.77 34.56,33.53 31.24,33.53 30.16,34.6 R16.2 | U$3.4 3.41,32.91 1.78,34.54 1.78,40.39 3.05,41.66 C4.1 | v35.56,32.26 35.56,32.77 | v45.72,17.78 45.57,17.93 U$2.7 41.65,17.93 41.15,18.43 | U3.1 27.63,33.21 v28.19,33.78 | 35.56,32.77 39.62,32.77 41.15,34.29 41.15,34.54 41.53,34.93 U$2.41 43.69,34.93 43.69,34.92 | IC4.5 39.35,43.86 39.35,43.61 | R8.2 48.77,9.4 v48.77,10.16 | 41.02,18.93 41.02,18.43 41.15,18.43 | U$2.8 41.15,18.43 | U$2.42 43.57,35.43 43.69,35.31 43.69,34.92 | 43.69,34.92 43.69,34.54 43.56,34.42 42.41,34.42 U$2.40 | R15.1 v30.61,37.08
  Top 0.406: 39.35,43.61 39.35,42.93 C1.1 40.13,41.66 v40.89,40.89 39.88,39.88 C2.1
  Top 0.61: 31.24,40.56 28.6,40.56 25.97,43.18 5.08,43.18 5.08,41.67 C4.1
  Bottom 0.254: 38.86,35.05 38.35,35.05 v35.56,32.26 35.31,32.26 32.51,35.05 29.46,35.05 29.34,34.92 | v40.89,40.89 38.86,38.86 38.86,35.05 | 38.86,35.05 39.88,36.07 45.21,36.07 46.74,34.54 46.74,26.42 43.43,23.11 43.43,20.07 v45.72,17.78 47.24,16.26 47.24,11.68 v48.77,10.16 | v28.19,33.78 29.34,34.92 | v30.61,37.08 29.34,35.81 29.34,34.92

### Text on the board
tPlace: SCL | SDA | 2.8" TFT LCD shield | w/Cap Touch | and microSD | TFT CS #10 / TFT DC #9 / Card CS #4 | I2C jumpers for <R3 | v2.3 | TFT: ILI9341 SPI / TS: FT6206 I2C | ICSP | SCK | SO | SI | 13 | 12 | 11 | back / lite | Reset | TS int | #7 | Leo/Mega / use ICSP & / cut 11-13 | #5